# Altium project routed.PrjPcb
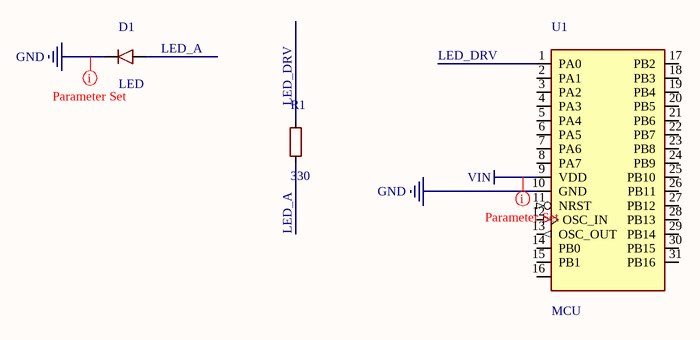
[diagram p0: routed.SchDoc]
1 sheet, 3 parts. Net scope: global (net labels, ports and power ports of the same name join across sheets).
Board file: routed.PcbDoc

## Sheet routed.SchDoc
size A4

### Parts
D1  LED  [Mini_LED_THT_3mm]
R1  330  [Mini_R_0603]
U1  MCU  [Mini_QFP-32_7x7mm_P0.8mm]

### Nets
GND: D1.1(K) U1.10(GND)
VIN: U1.9(VDD)
LED_A: D1.2(A) R1.2
LED_DRV: R1.1 U1.1(PA0)

Not connected (* = marked no-connect by the designer): U1 2(PA1) 3(PA2) 4(PA3) 5(PA4) 6(PA5) 7(PA6) 8(PA7) 11(NRST) 12(OSC_IN) 13(OSC_OUT) 14(PB0) 15(PB1) 16 17(PB2) 18(PB3) 19(PB4) 20(PB5) 21(PB6) 22(PB7) 23(PB8) 24(PB9) 25(PB10) 26(PB11) 27(PB12) 28(PB13) 29(PB14) 30(PB15) 31(PB16) 32(EP)

### Layout directives
net class PWR: GND, VIN

### Library data of the parts
D1 = Mini_LED
R1 = Mini_R
U1 = Mini_QFP32_IC